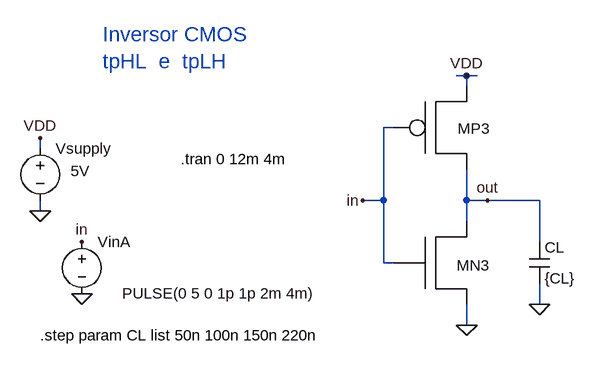
[diagram p0: schematic inverter-delay.asc]
inverter-delay.asc, the LTspice schematic file:
Version 4
SHEET 1 2472 680
WIRE 384 -128 368 -128
WIRE 400 -128 384 -128
WIRE 384 -112 384 -128
WIRE 272 -48 256 -48
WIRE -272 -16 -272 -32
WIRE 256 64 256 -48
WIRE 256 64 224 64
WIRE 384 64 384 16
WIRE 416 64 384 64
WIRE 496 64 416 64
WIRE -272 80 -272 64
WIRE 384 96 384 64
WIRE 496 128 496 64
WIRE 256 160 256 64
WIRE 272 160 256 160
WIRE 496 224 496 192
WIRE 384 256 384 224
FLAG -272 80 0
FLAG -208 208 0
FLAG -272 -32 VDD
FLAG -208 128 in
FLAG 384 -128 VDD
FLAG 416 64 out
FLAG 384 256 0
FLAG 224 64 in
FLAG 496 224 0
SYMBOL voltage -272 -32 R0
WINDOW 3 47 51 Left 2
SYMATTR Value 5V
SYMATTR InstName Vsupply
SYMBOL voltage -208 112 R0
WINDOW 123 0 0 Left 2
WINDOW 39 0 0 Left 2
WINDOW 3 62 95 Left 2
SYMATTR Value PULSE(0 5 0 1p 1p 2m 4m)
SYMATTR InstName VinA
SYMBOL PMOSX 352 -64 R0
SYMATTR InstName MP3
SYMBOL NMOSX 352 144 R0
SYMATTR InstName MN3
SYMBOL cap 480 128 R0
SYMATTR InstName CL
SYMATTR Value {CL}
TEXT -56 0 Left 2 !.tran 0 12m 4m
TEXT -176 -192 Left 3 ;Inversor CMOS\ntpHL  e  tpLH
TEXT -272 272 Left 2 !.step param CL list 50n 100n 150n 220n

The netlist it stands for:
* inverter-delay.asc
Vsupply VDD 0 5V
VinA in 0 PULSE(0 5 0 1p 1p 2m 4m)
XMP3 out in VDD PMOSX  ; pins D G S
XMN3 out in 0 NMOSX  ; pins D G S
CL out 0 {CL}
.tran 0 12m 4m
* Inversor CMOS
* tpHL  e  tpLH
.step param CL list 50n 100n 150n 220n
.lib MOS4007.txt
.backanno
.end